# Altium project NES Power Board Ver A.PrjPcb
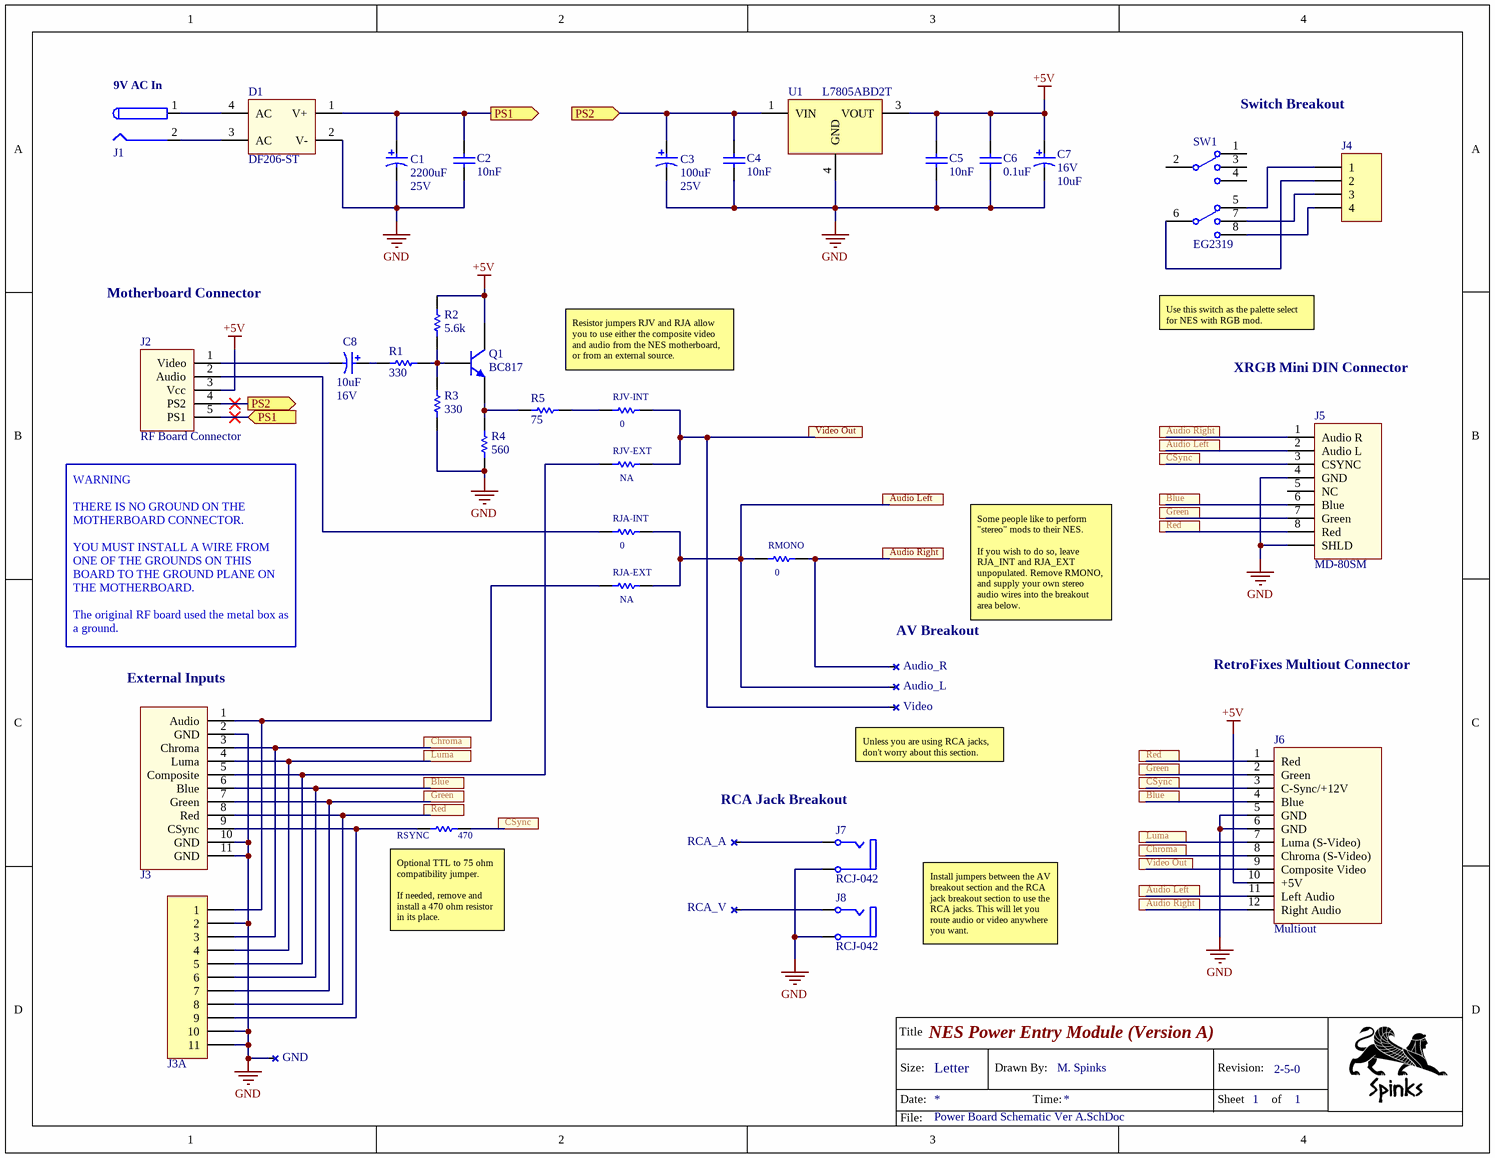
[diagram p0: Power Board Schematic Ver A.SchDoc]
ProjectRevision: 2-5-0
1 sheet, 38 parts. Net scope: flat (ports and power ports of the same name join across sheets).
Board file: Power PCB Ver A.PcbDoc

## Sheet Power Board Schematic Ver A.SchDoc: NES Power Entry Module (Version A)
size Letter; DrawnBy: M. Spinks; Organization: Altium Limited; SheetNumber: 1; SheetTotal: 1

### Parts
Audio_L  Wire Pad  [WIREPAD-09-15]  (value not drawn)
Audio_R  Wire Pad  [WIREPAD-09-15]  (value not drawn)
C1  value 2200uF  Voltage: 25V  [TH CAP-12.5X25MM-A1K2]  (hidden comment: Cap Aluminum)
C2  value 10nF  [CAP 0805_N]  (hidden comment: Cap Ceramic)
C3  value 100uF  Voltage: 25V  [TH CAP-6.3X11MM-A1K2]  (hidden comment: Cap Aluminum)
C4  value 10nF  [CAP 0805_N]  (hidden comment: Cap Ceramic)
C5  value 10nF  [CAP 0805_N]  (hidden comment: Cap Ceramic)
C6  value 0.1uF  [CAP 0805_N]  (hidden comment: Cap Ceramic)
C7  value 10uF  Voltage: 16V  [CAP EIA-A (3216) A1K2]  (hidden comment: Cap Tantalum)
C8  value 10uF  Voltage: 16V  [CAP EIA-A (3216) A1K2]  (hidden comment: Cap Tantalum)
D1  DF206-ST  [DFS4]
GND  Wire Pad  [WIREPAD-09-15]  (value not drawn)
J1  PJ-037A  [PWR-JCK-ALT (PJ-037A/B)]  (value not drawn)
J2  RF Board Connector  [RF Board Connector]
J3  1.27mm Pitch  [HDR1x11-15MM VERTL - L]  (value not drawn)
J3A  1.27mm Pitch  [SMD1x11-127MM]  (value not drawn)
J4  Header 1x4 1.27mm  [HDR1X4-15MM VERT - L]  (value not drawn)
J5  MD-80SM  [MINI-DIN-8-ALT (MD-80SM)]
J6  Multiout  [Multiout-2]
J7  RCJ-042  [RCA-JCK-1 (RCJ-042-ALT1)]
J8  RCJ-042  [RCA-JCK-1 (RCJ-042-ALT1)]
Q1  value BC817  [SOT23-3]  (hidden comment: Transistor NPN)
R1  value 330  [RES 0805_N]  (hidden comment: Resistor)
R2  value 5.6k  [RES 0805_N]  (hidden comment: Resistor)
R3  value 330  [RES 0805_N]  (hidden comment: Resistor)
R4  value 560  [RES 0805_N]  (hidden comment: Resistor)
R5  value 75  [RES 0805_N]  (hidden comment: Resistor)
RCA_A  Wire Pad  [WIREPAD-09-15]  (value not drawn)
RCA_V  Wire Pad  [WIREPAD-09-15]  (value not drawn)
RJA-EXT  value NA  [RES 0805_N]  (hidden comment: Resistor)
RJA-INT  value 0  [RES 0805_N]  (hidden comment: Resistor)
RJV-EXT  value NA  [RES 0805_N]  (hidden comment: Resistor)
RJV-INT  value 0  [RES 0805_N]  (hidden comment: Resistor)
RMONO  value 0  [RES 0805_N]  (hidden comment: Resistor)
RSYNC  value 470  [RES 0805_N]  (hidden comment: Resistor)
SW1  value EG2319  [SW-DP3T (EG2319)]  (hidden comment: DP3T)
U1  L7805ABD2T  [D2PAK (TO-263)]
Video  Wire Pad  [WIREPAD-09-15]  (value not drawn)

### Ports
PS1 (in), PS1 (out), PS2 (in), PS2 (out)

### Nets
+5V: C5.2 C6.2 C7.1(A) J2.3(Vcc) J6.10(+5V) Q1.3(C) R2.1 U1.3(VOUT)
GND: C1.2(K) C2.1 C3.2(K) C4.1 C5.1 C6.1 C7.2(K) D1.2(V-) GND.1 J3.2(GND) J3.10(GND) J3.11(GND) J3A.2 J3A.10 J3A.11 J5.4(GND) J5.SHLD J6.5(GND) J6.6(GND) J7.2(Sleeve) J8.2(Sleeve) R3.2 R4.1 U1.4(GND)
Audio Left: Audio_L.1 J5.2(Audio_L) J6.11(Left_Audio) RJA-EXT.1 RJA-INT.1 RMONO.2
Audio Right: Audio_R.1 J5.1(Audio_R) J6.12(Right_Audio) RMONO.1
Blue: J3.6(Blue) J3A.6 J5.6(Blue) J6.4(Blue)
Chroma: J3.3(Chroma) J3A.3 J6.8(Chroma_(S-Video))
CSync: J5.3(CSYNC) J6.3(C-Sync/+12V) RSYNC.1
Green: J3.7(Green) J3A.7 J5.7(Green) J6.2(Green)
Luma: J3.4(Luma) J3A.4 J6.7(Luma_(S-Video))
Red: J3.8(Red) J3A.8 J5.8(Red) J6.1(Red)
Video Out: J6.9(Composite_Video) RJV-EXT.1 RJV-INT.1 Video.1
NetC1_1: C1.1(A) C2.2 D1.1(V+) J2.5(PS1) ; port PS1
NetC3_1: C3.1(A) C4.2 J2.4(PS2) U1.1(VIN) ; port PS2
NetC8_1: C8.1(A) R1.2
NetC8_2: C8.2(K) J2.1(Video)
NetD1_3: D1.3(AC) J1.2
NetD1_4: D1.4(AC) J1.1
NetJ2_2: J2.2(Audio) RJA-INT.2
NetJ3_1: J3.1(Audio) J3A.1 RJA-EXT.2
NetJ3_5: J3.5(Composite) J3A.5 RJV-EXT.2
NetJ3_9: J3.9(CSync) J3A.9 RSYNC.2
NetJ4_1: J4.1 SW1.5
NetJ4_2: J4.2 SW1.6
NetJ4_3: J4.3 SW1.7
NetJ4_4: J4.4 SW1.8
NetJ7_1: J7.1(Tip) RCA_A.1
NetJ8_1: J8.1(Tip) RCA_V.1
NetQ1_1: Q1.1(B) R1.1 R2.2 R3.1
NetQ1_2: Q1.2(E) R4.2 R5.2
NetR5_1: R5.1 RJV-INT.2

Not connected (* = marked no-connect by the designer): J5 5(NC); SW1 1 2 3 4

### Notes on the sheet
- (near J1) 9V AC In
- Switch Breakout
- Motherboard Connector
- Resistor jumpers RJV and RJA allow you to use either the composite video and audio from the NES motherboard, or from an external source.
- Use this switch as the palette select for NES with RGB mod.
- XRGB Mini DIN Connector
- WARNING
  THERE IS NO GROUND ON THE MOTHERBOARD CONNECTOR.
  YOU MUST INSTALL A WIRE FROM ONE OF THE GROUNDS ON THIS BOARD TO THE GROUND PLANE ON THE MOTHERBOARD.
  The original RF board used the metal box as a ground.
- (near Audio_R) AV Breakout
- Some people like to perform "stereo" mods to their NES.
  If you wish to do so, leave RJA_INT and RJA_EXT unpopulated. Remove RMONO, and supply your own stereo audio wires into the breakout area below.
- (near J3) External Inputs
- RetroFixes Multiout Connector
- (near Video) Unless you are using RCA jacks, don't worry about this section.
- RCA Jack Breakout
- (near RSYNC) Optional TTL to 75 ohm compatibility jumper.
  If needed, remove and install a 470 ohm resistor in its place.
- Install jumpers between the AV breakout section and the RCA jack breakout section to use the RCA jacks. This will let you route audio or video anywhere you want.
- Title
- Size:
- Date:
- Letter
- Drawn By:
- Time:
- Revision:
- Sheet
- of
- File:

### Library data of the parts
Audio_L Audio_R GND RCA_A RCA_V Video = -Wire Pad: Wire Pad, 1 Pin, Through Hole, Vertical
C1 = TH-ALUM-8-22-25V (ECA-1EHG222): CAP, ALUM, TH, 12.5x25mm, 2200uF, 25V, 20%, Pitch 5.0mm; ESR: *; ReferencePart: ECA-1EHG222; Supplier 1: Mouser; Supplier Part Number 1: 667-ECA-1EHG222
C2 C4 C5 = 0603-X7R-3-10-50V: CAP, CER, 0805, 10nF, 50V, X7R, 10%; ReferencePart: VJ0603Y103KXACW1BC; Voltage: 50V
C3 = TH-ALUM-7-10-25V (ECA-1EM101): CAP, ALUM, TH, 6.3x11mm, 100uF, 25V, 20%, Pitch 2.5mm; ESR: *; ReferencePart: ECA-1EM101; Supplier 1: Mouser; Supplier Part Number 1: 667-ECA-1EM101
C6 = 0805-X7R-4-10-50V: CAP, CER, 0805, 0.1uF, 50V, X7R, 10%; ReferencePart: VJ0805Y104KXXCW1BC; Voltage: 50V
C7 C8 = 1206-TANT-6-10-16V (TAJA106K016RNJ): CAP, TANT,  1206, 10uF, 16V, 10%; Supplier 1: Mouser; Supplier Part Number 1: 581-TAJA106K016R
D1 = Bridge (DF206-ST): Full Wave Diode Bridge; Value: DF206-ST; Supplier 1: Mouser; Supplier Part Number 1: 750-DF206ST-G
J1 = PWR-JCK (PJ-037A): 2.1mm ID, DC Power Supply Connector, 2 Pin; Value: PJ-037A; Supplier 1: Mouser; Supplier Part Number 1: 490-PJ-037A
J2 = RF Board Connector: Motherboard Connector to RF/Power Module; Value: RF Board Connector
J3 = RF Board Mod Input Header: Video and audio inputs for the RF Board Mod; Value: 1.27mm Pitch
J3A = RF Board Mod Input Header_1: Video and audio inputs for the RF Board Mod; Value: 1.27mm Pitch
J4 = Header 1x4 - 1.5mm Vert: Header, 4 Pin, 1.5mm Pitch, Vertical; Value: Header 1x4 1.27mm
J5 = Mini-XRGB (MD-80SM): 8 Pin Mini DIN Connector, Shielded, Through Hole, Right Angle; Label: *; Supplier 1: Mouser; Supplier Part Number 1: 490-MD-80SM; Value: MD-80SM
J6 = Multiout Connector: SNES Multiout Connector; Value: Multiout
J7 J8 = RCA-JCK-1 (RCJ-042): RCA Phono Jack, Right Angle; Value: RCJ-042; Supplier 1: Mouser; Supplier Part Number 1: 490-RCJ-042
Q1 = BC817 NPN: General Purpose Transistor, NPN, 3-Pin, B1E2C3; Supplier 1: Mouser; Supplier Part Number 1: 863-BC817-40LT1G
R1-R5 RJA-EXT RJA-INT RJV-EXT RJV-INT RMONO RSYNC = -Resistor: RES, SMD
SW1 = SW-DP3T (EG2319): Dual Pole, Three Throw; Supplier 1: Mouser; Supplier Part Number 1: 612-EG2319
U1 = L7805ABD2T: Fixed 5V Regulator, 1.5A, D2PAK; Value: L7805ABD2T; Supplier 1: Mouser; Supplier Part Number 1: 511-L7805ABD2T-TR